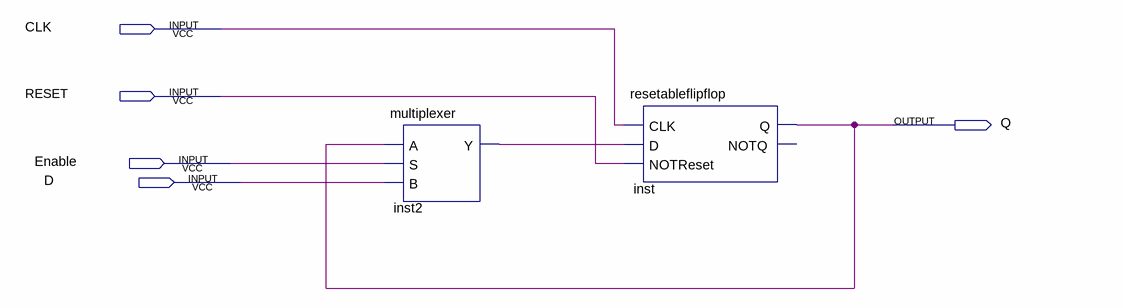
[diagram p0: schematic sheet]
// Quartus schematic enabledresettableflipflop.bdf as structural Verilog: 2 symbols, 5 pins
module enabledresettableflipflop (
  input  CLK,
  input  RESET,
  input  Enable,
  input  D,
  output Q
);

  wire inst2_y;

  multiplexer inst2 (.A(Q), .S(Enable), .B(D), .Y(inst2_y));
  resetableflipflop inst (.CLK(CLK), .D(inst2_y), .NOTReset(RESET), .Q(Q));  // open: NOTQ
endmodule
